# EAGLE design upper_meter (EAGLE 6.5.0)
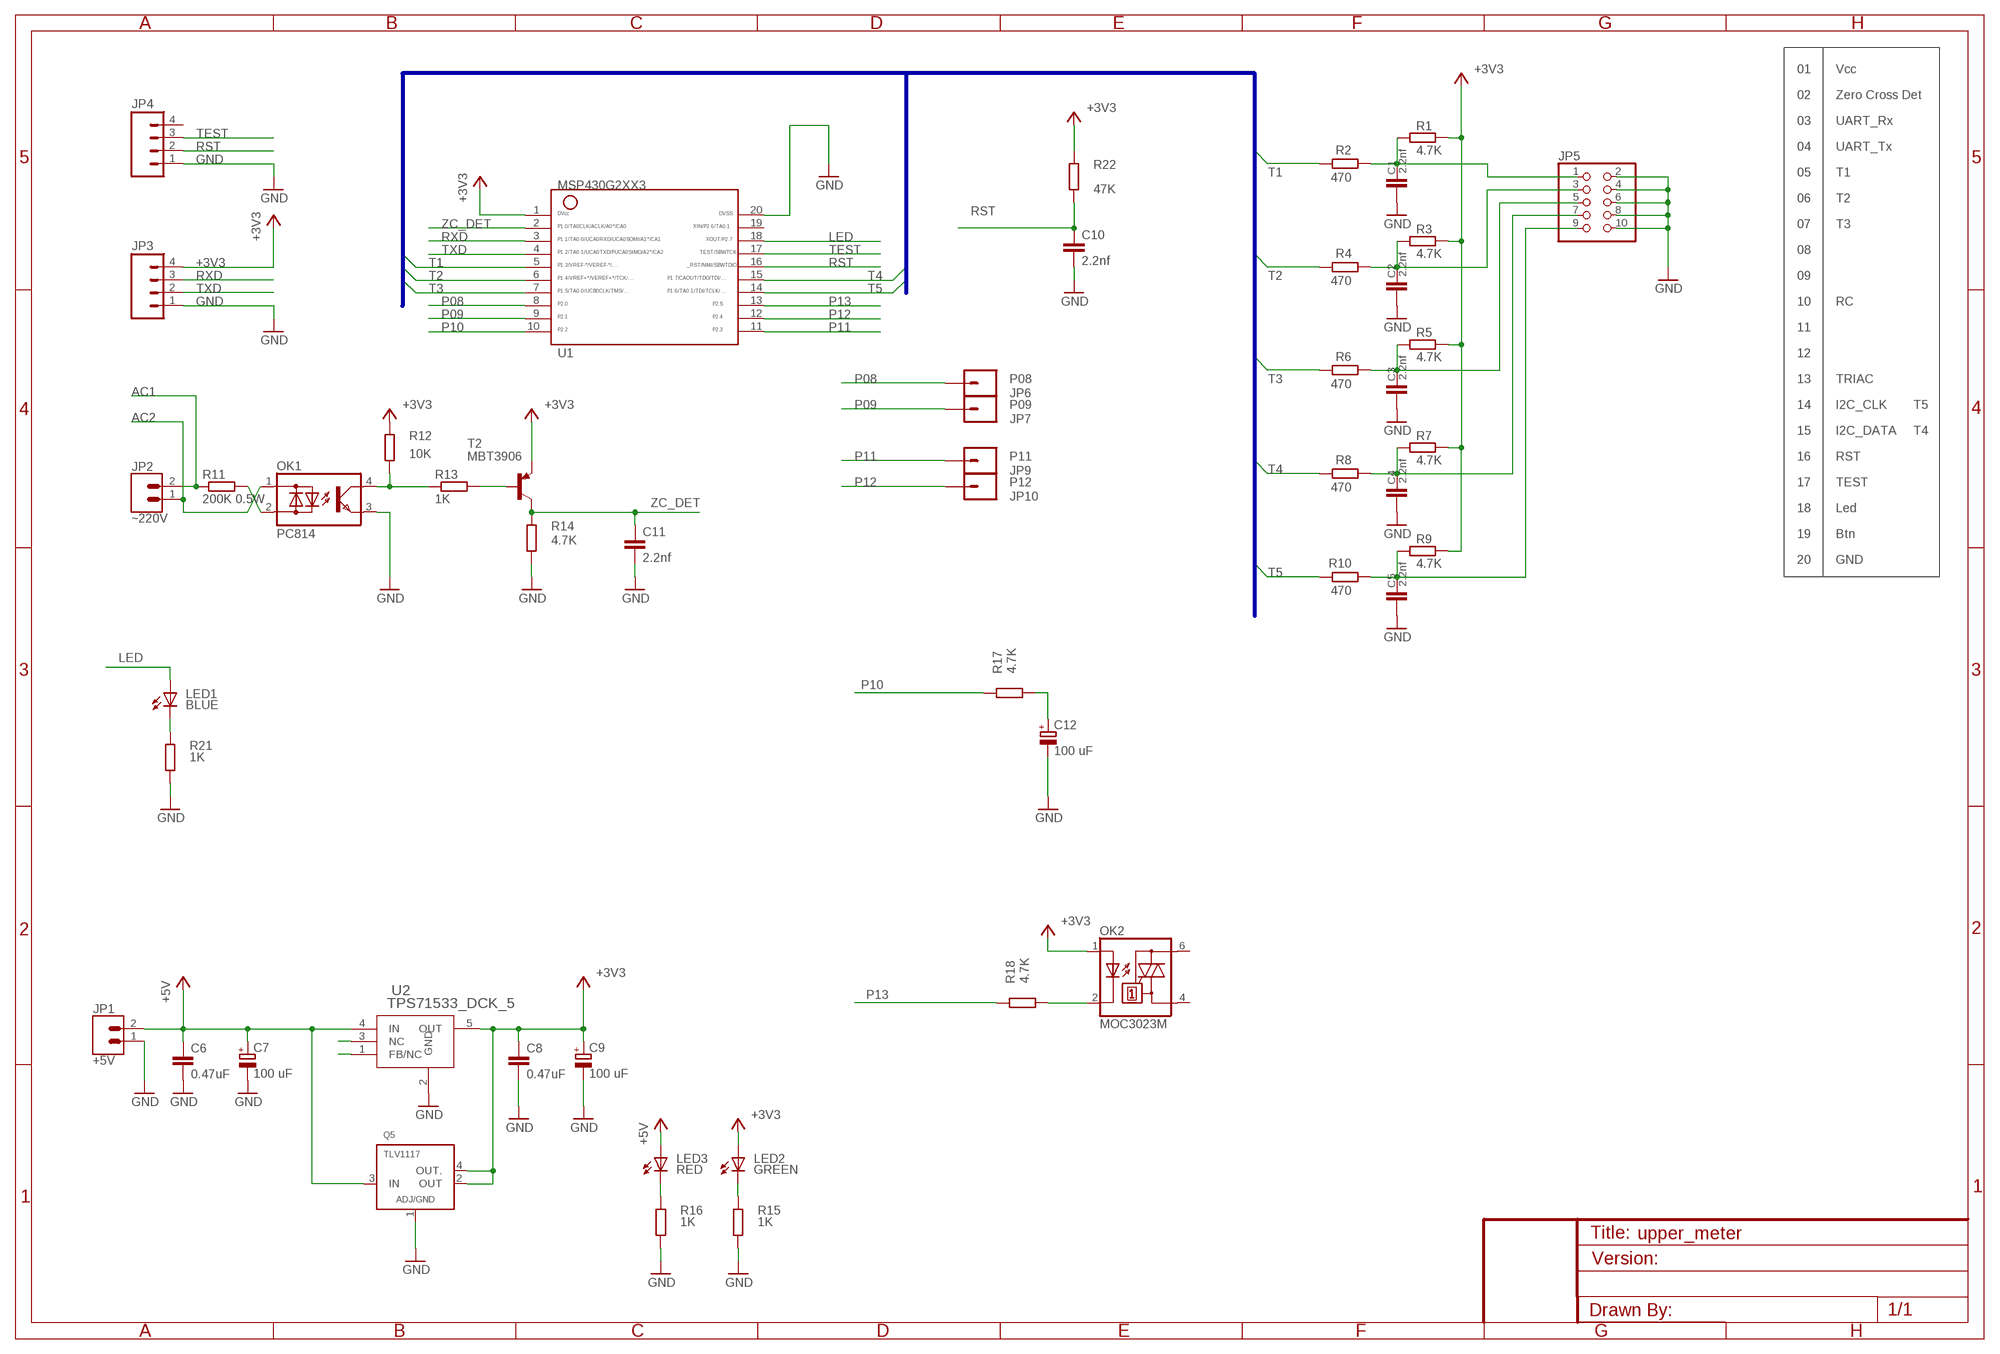
[diagram p0: schematic, sheet 1]

## Parts
C1  2.2nf  C-EUC0805  [C0805]
C2  2.2nf  C-EUC0805  [C0805]
C3  2.2nf  C-EUC0805  [C0805]
C4  2.2nf  C-EUC0805  [C0805]
C5  2.2nf  C-EUC0805  [C0805]
C6  0.47uF  C-EUC0805  [C0805]
C7  100 uF  CPOL-EUE2.5-7  [E2,5-7]
C8  0.47uF  C-EUC0805  [C0805]
C9  100 uF  CPOL-EUE2.5-7  [E2,5-7]
C10  2.2nf  C-EUC0805  [C0805]
C11  2.2nf  C-EUC0805  [C0805]
C12  100 uF  CPOL-EUE2.5-7  [E2,5-7]
JP1  +5V  BLUE_TERM  [BLUE_TERM]
JP2  ~220V  BLUE_TERM  [BLUE_TERM]
JP3  M04PTH  [1X04]
JP4  M04PTH  [1X04]
JP5  PINHD-2X5  [2X05]
JP6  P08  M01PTH  [1X01]
JP7  P09  M01PTH  [1X01]
JP9  P11  M01PTH  [1X01]
JP10  P12  M01PTH  [1X01]
LED1  BLUE  LEDCHIP-LED0805  [CHIP-LED0805]
LED2  GREEN  LEDCHIP-LED0805  [CHIP-LED0805]
LED3  RED  LEDCHIP-LED0805  [CHIP-LED0805]
OK1  PC814  [DIL04]
OK2  MOC3023M  [DIL06]
Q5  TLV1117  [SOT223-4]
R1  4.7K  R-EU_R0805  [R0805]
R2  470  R-EU_R0805  [R0805]
R3  4.7K  R-EU_R0805  [R0805]
R4  470  R-EU_R0805  [R0805]
R5  4.7K  R-EU_R0805  [R0805]
R6  470  R-EU_R0805  [R0805]
R7  4.7K  R-EU_R0805  [R0805]
R8  470  R-EU_R0805  [R0805]
R9  4.7K  R-EU_R0805  [R0805]
R10  470  R-EU_R0805  [R0805]
R11  200K 0.5W  R-EU_0309/12  [0309/12]
R12  10K  R-EU_R0805  [R0805]
R13  1K  R-EU_R0805  [R0805]
R14  4.7K  R-EU_R0805  [R0805]
R15  1K  R-EU_R0805  [R0805]
R16  1K  R-EU_R0805  [R0805]
R17  4.7K  R-EU_R0805  [R0805]
R18  4.7K  R-EU_R0805  [R0805]
R21  1K  R-EU_R0805  [R0805]
R22  47K  R-EU_R0805  [R0805]
T2  MBT3906  MMBT3906LT1-PNP-SOT23-BEC  [SOT23-BEC]
U1  G2XX3---PW20  [PW20]
U2  TPS71533_DCK_5  [DCK5]

## Nets
+3V3 [3V]: C8.1 C9.+ JP3.4 LED2.A OK2.1(A) Q5.2(OUT) Q5.4(OUT.) R1.1 R3.1 R5.1 R7.1 R9.1 R12.2 R22.2 T2.E U1.1 U2.5(OUT)
+5V [5V]: C6.1 C7.+ JP1.2 LED3.A Q5.3(IN) U2.4(IN)
AC1: JP2.2 R11.1
AC2: JP2.1 OK1.1(AC1)
GND [GND]: C1.1 C2.1 C3.1 C4.1 C5.1 C6.2 C7.- C8.2 C9.- C10.2 C11.2 C12.- JP1.1 JP3.1 JP4.1 JP5.2 JP5.4 JP5.6 JP5.8 JP5.10 OK1.3(E) Q5.1(ADJ/GND) R14.1 R15.1 R16.1 R21.1 U1.20 U2.2(GND)
LED: LED1.A U1.18
N$1: C2.2 JP5.3 R3.2 R4.2
N$2: C1.2 JP5.1 R1.2 R2.2
N$3: C3.2 JP5.5 R5.2 R6.2
N$4: C4.2 JP5.7 R7.2 R8.2
N$5: C5.2 JP5.9 R9.2 R10.2
N$6: R13.2 T2.B
N$7: LED2.C R15.2
N$8: LED3.C R16.2
N$9: OK1.4(C) R12.1 R13.1
N$10: C12.+ R17.1
N$11: OK2.2(C) R18.1
N$15: OK1.2(AC2) R11.2
N$23: LED1.C R21.2
N$32: U2.3(NC)
N$33: U2.1(FB/NC)
P08: JP6.1 U1.8
P09: JP7.1 U1.9
P10: R17.2 U1.10
P11: JP9.1 U1.11
P12: JP10.1 U1.12
P13: R18.2 U1.13
RST: C10.1 JP4.2 R22.1 U1.16
RXD: JP3.3 U1.3
T1: R2.1 U1.5
T2: R4.1 U1.6
T3: R6.1 U1.7
T4: R8.1 U1.15
T5: R10.1 U1.14
TEST: JP4.3 U1.17
TXD: JP3.2 U1.4
ZC_DET: C11.1 R14.2 T2.C U1.2
Unconnected: JP4.4 OK2.4(A1) OK2.6(A2) U1.19

## Buses
T[1..5]

## Notes on the sheet
- 01 | Vcc
- 02 | Zero Cross Det
- 03 | UART_Rx
- 04 | UART_Tx
- 05 | T1
- 06 | T2
- 07 | T3
- 08
- 09
- 10 | RC
- 11
- 12
- 13 | TRIAC
- 14 | I2C_CLK | T5
- 15 | I2C_DATA | T4
- 16 | RST
- 17 | TEST
- 18 | Led
- 19 | Btn
- 20 | GND

## Library data of the parts
C1-C4 C6 C8 C10 C11 = rcl:C-EU: CAPACITOR, European symbol
C5 = resistor:C-EU: CAPACITOR, European symbol
C7 C9 C12 = rcl:CPOL-EU: POLARIZED CAPACITOR, European symbol
JP1 JP2 = jlab:BLUE_TERM
JP3 JP4 = SparkFun:M04: Header 4 Standard 4-pin 0.1" header. Use with straight break away headers (SKU : PRT-00116), right angle break away headers (PRT-00553), swiss pins (PRT-00743), machine pins (PRT-00117), and female headers (PRT-00115). Molex polarized connector foot print use with SKU : PRT-08231 with associated crimp pins and housings. 1MM SMD Version SKU: PRT-10208
JP5 = pinhead:PINHD-2X5: PIN HEADER
JP6 JP7 JP9 JP10 = SparkFun:M01: Header 1 Standard 1-pin 0.1" header. Use with straight break away headers (SKU : PRT-00116), right angle break away headers (PRT-00553), swiss pins (PRT-00743), machine pins (PRT-00117), and female headers (PRT-00115).
LED1-LED3 = jlab:LED: LED OSRAM: - CHIPLED LG R971, LG N971, LY N971, LG Q971, LY Q971, LO R971, LY R971 LH N974, LH R974 LS Q976, LO Q976, LY Q976 LO Q996 - Hyper CHIPLED LW Q18S LB Q993, LB Q99A, LB R99A - SideLED LS A670, LO A670, LY A670, LG A670, LP A670 LB A673, LV A673, LT A673, LW A673 LH A674 LY A675 LS A676, LA A676, LO A676, LY A676, LW A676 LS A679, LY A679, LG A679 - Hyper Micro SIDELED® LS Y876, LA Y876, LO Y876, LY Y876 LT Y87S - SmartLED LW L88C, LW L88S LB L89C, LB L89S, LG L890 LS L89K, LO L89K, LY L89K LS L896, LA L896, LO L896, LY L896 - TOPLED LS T670, LO T670, LY T670, LG T670, LP T670 LSG T670, LSP T670, LSY T670, LOP T670, LYG T670 LG T671, LOG T671, LSG T671 LB T673, LV T673, LT T673, LW T673 LH T674 LS T676, LA T676, LO T676, LY T676, LB T676, LH T676, LSB T676, LW T676 LB T67C, LV T67C, LT T67C, LS T67K, LO T67K, LY T67K, LW E67C LS E67B, LA E67B, LO E67B, LY E67B, LB E67C, LV E67C, LT E67C LW T67C LS T679, LY T679, LG T679 LS T770, LO T770, LY T770, LG T770, LP T770 LB T773, LV T773, LT T773, LW T773 LH T774 LS E675, LA E675, LY E675, LS T675 LS T776, LA T776, LO T776, LY T776, LB T776 LHGB T686 LT T68C, LB T68C - Hyper Mini TOPLED® LB M676 - Mini TOPLED Santana® LG M470 LS M47K, LO M47K, LY M47K Source: http://www.osram.convergy.de LUXEON: - LUMILED® LXK2-PW12-R00, LXK2-PW12-S00, LXK2-PW14-U00, LXK2-PW14-V00 LXK2-PM12-R00, LXK2-PM12-S00, LXK2-PM14-U00 LXK2-PE12-Q00, LXK2-PE12-R00, LXK2-PE12-S00, LXK2-PE14-T00, LXK2-PE14-U00 LXK2-PB12-K00, LXK2-PB12-L00, LXK2-PB12-M00, LXK2-PB14-N00, LXK2-PB14-P00, LXK2-PB14-Q00 LXK2-PR12-L00, LXK2-PR12-M00, LXK2-PR14-Q00, LXK2-PR14-R00 LXK2-PD12-Q00, LXK2-PD12-R00, LXK2-PD12-S00 LXK2-PH12-R00, LXK2-PH12-S00 LXK2-PL12-P00, LXK2-PL12-Q00, LXK2-PL12-R00 Source: www.luxeon.com KINGBRIGHT: KA-3528ASYC Source: www.kingbright.com
OK1 = optocoupler:PC814: SHARP OPTO COUPLER; OC_FARNELL: 9707662; OC_NEWARK: unknown
OK2 = optocoupler:MOC30*M: RANDOM-PHASE OPTOISOLATORS TRIAC DRIVER OUTPUT Source: http://www.fairchildsemi.com MOC3020-M.pdf; MF: FAIRCHILD SEMICONDUCTOR; MPN: MOC3023-M; OC_FARNELL: 1021367; OC_NEWARK: 72K8896
Q5 = ti-parts:TLV1117: LDO VOLTAGE REGULATOR
R1-R18 R21 R22 = rcl:R-EU_: RESISTOR, European symbol
T2 = transistor-neu-to92:*-PNP-: PNP Transistror
U1 = TI_MSP430_v16:G2XX3---PW20: MSP430G2XX1 TSSOP (PW) 20 Pin Package
U2 = ti_exports:TPS71533_DCK_5; DATASHEETURL: http://www.ti.com/lit/gpn/TPS71533; DESCRIPTION: Single Output LDO, 50mA, Fixed(3.3V), High Input Voltage, Low Quiescent Current; FAMILY_NAME: SINGLE CHANNEL LDO; GENERIC_PART_NUMBER: TPS71533; INDUSTRY_STD_PKG_TYPE: SC70; MANUFACTURER: Texas Instruments; MANUFACTURER_PART_NUMBER: tps71533_dck_5; PACKAGE_DESIGNATOR: DCK; PIN_COUNT: 5; VENDOR: Texas Instruments

## Net classes
1 5V: width 0.305 mm, drill 0.305 mm, clearance 0.305 mm
2 3V: width 0.305 mm, drill 0.305 mm, clearance 0.305 mm
3 GND: width 0.305 mm, clearance 0.305 mm

## Board
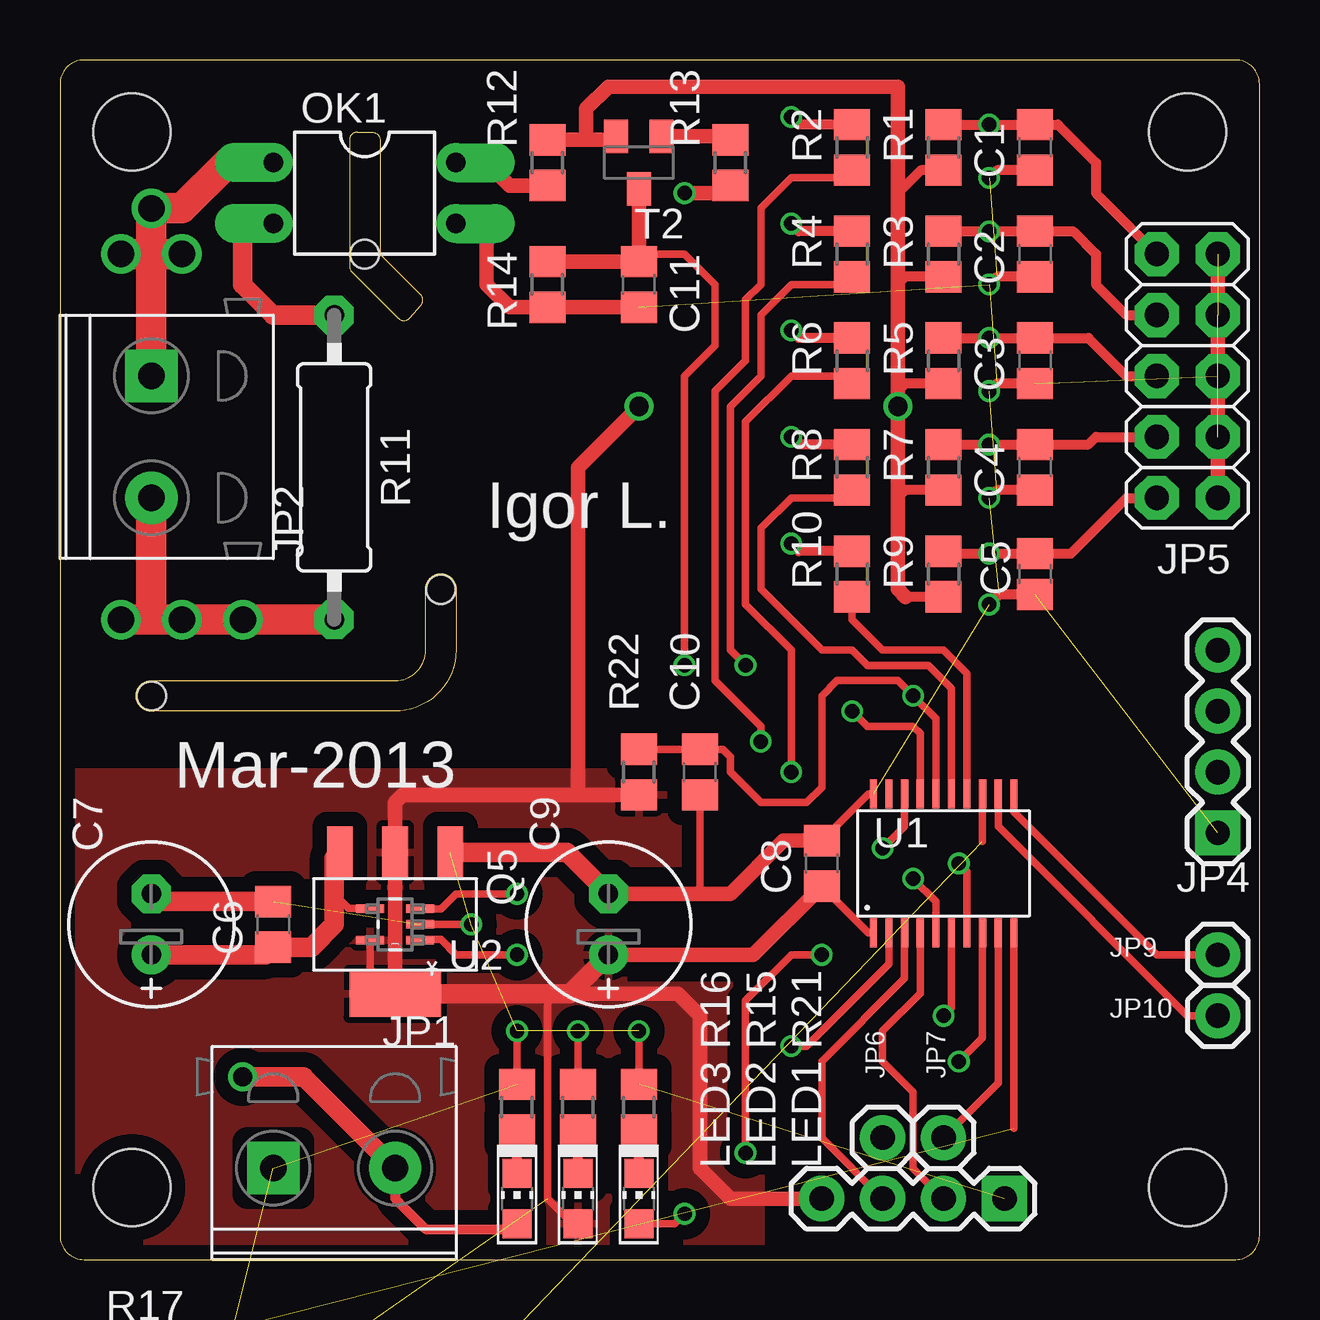
[diagram p1: board, top side]
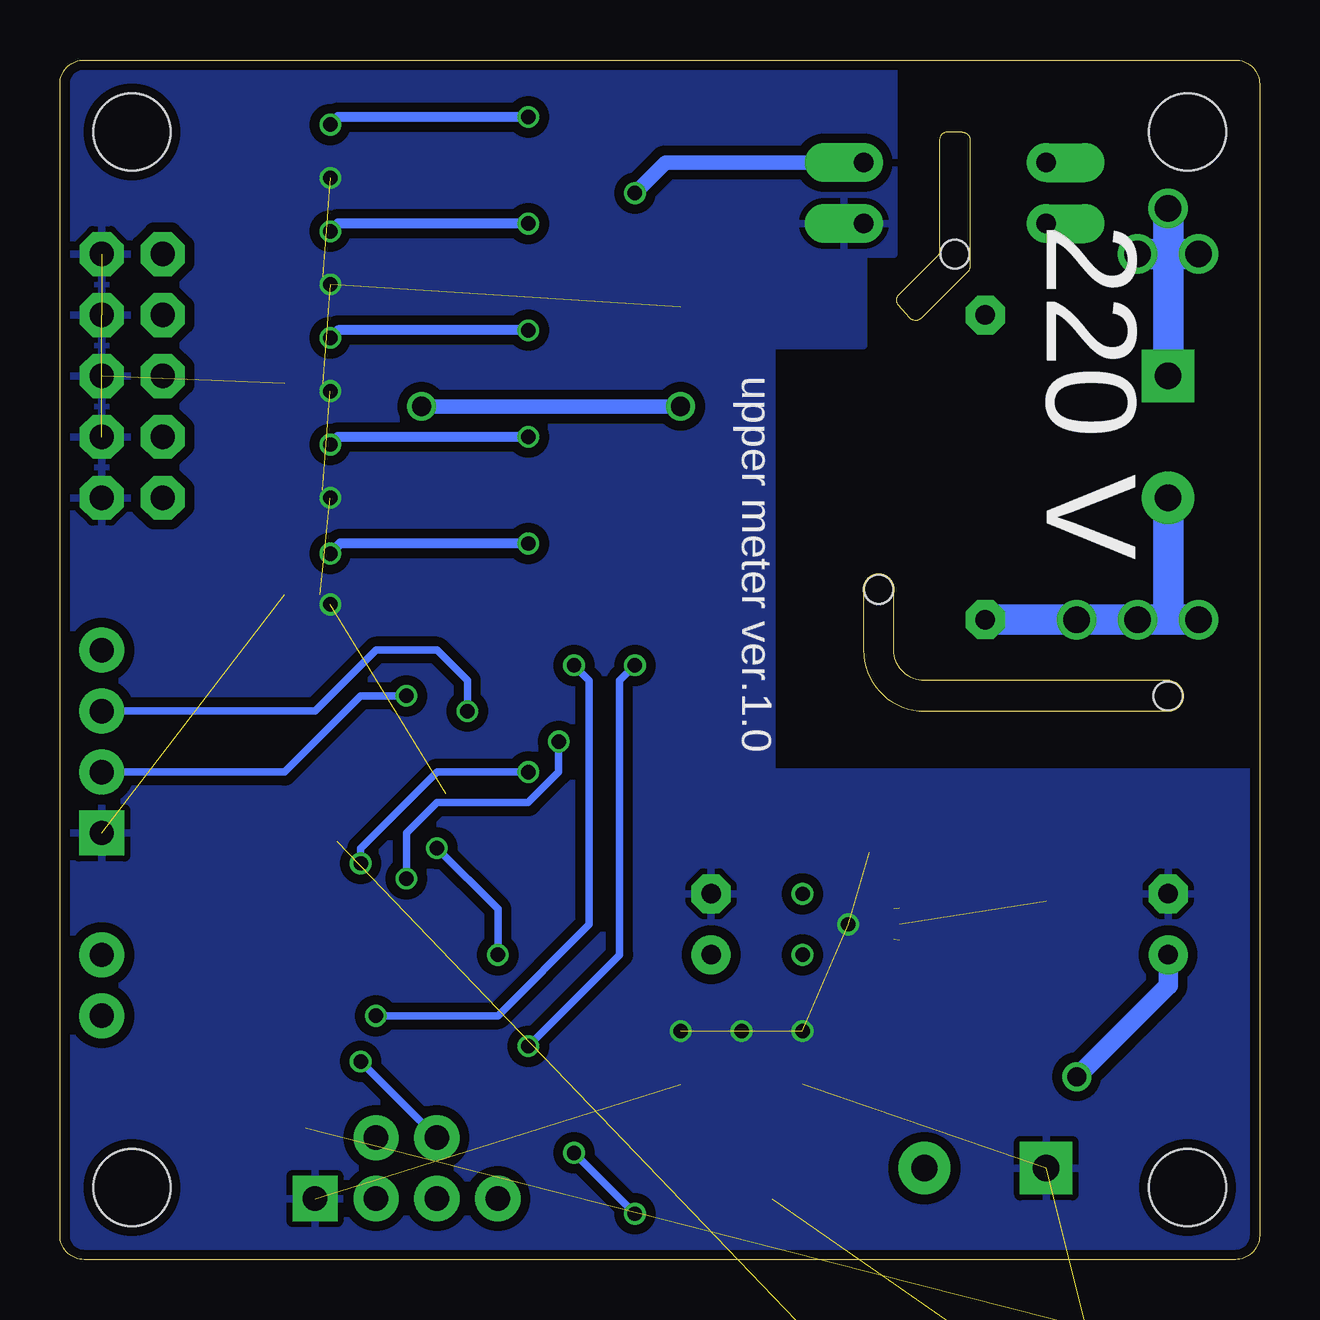
[diagram p2: board, bottom side, seen from below]

Size 50 x 50 mm. Coordinates in mm from the lower left corner, seen from the top.
Outline: 0,49 0,1 arc90 1,0 49,0 arc90 50,1 50,49 arc90 49,50 1,50 arc90 0,49
Copper layers (1*16): Top 0.035mm / dielectric 1.5mm / Bottom 0.035mm
Design rules "msp430": minimum track width 11mil, minimum drill 0.6mm, track to track 6mil, track to pad 6mil, pad to pad 6mil, via to via 6mil, smd to smd 0mil, copper to edge 10mil, drill to drill 10mil, minimum pad ring 16mil, minimum via ring 6mil, stop-mask expansion 2mil, vias tented up to drill 40mil, thermal gap 10mil
Holes 3.2 mm at 3,3 47,3 47,47 3,47
Holes 1.2 mm at 12.7,41.91 15.88,27.94 3.81,23.5
Milling: 20 lines

### Footprints (pad centres in the part's own frame; a part is rotated, then mirrored left to right if it is on the bottom)
C0805 = smd 1.3 x 1.5: 1 -0.95,0; 2 0.95,0
C0805' = smd 1.3 x 1.5: 1 -0.85,0; 2 0.85,0
E2,5-7 = drill 0.813 pad 1.6: + -1.27,0 | drill 0.813 pad 1.6 octagon: - 1.27,0
BLUE_TERM = drill 1.1 pad 2.184 square: 1 0,2.54 | drill 1.1 pad 2.184: 2 0,-2.54
1X04 = drill 1.016 pad 1.88 square: 1 0,0 | drill 1.016 pad 1.88: 2 2.54,0; 3 5.08,0; 4 7.62,0
2X05 = drill 1.016 octagon: 1 -5.08,-1.27; 2 -5.08,1.27; 3 -2.54,-1.27; 4 -2.54,1.27; 5 0,-1.27; 6 0,1.27; 7 2.54,-1.27; 8 2.54,1.27; 9 5.08,-1.27; 10 5.08,1.27
1X01 = drill 1.016 pad 1.88: 1 0,0
CHIP-LED0805 = smd 1.2 x 1.2: A 0,-1.05; C 0,1.05
DIL04 = drill 0.813 offset: 1 -1.27,-3.81; 2 1.27,-3.81; 3 1.27,3.81; 4 -1.27,3.81
DIL06 = drill 0.813 offset: 1 -2.54,-3.81; 2 0,-3.81; 3 2.54,-3.81; 4 2.54,3.81; 5 0,3.81; 6 -2.54,3.81
SOT223-4 = smd 1.067 x 2.184: 1 -2.3,-3; 2 0,-3; 3 2.3,-3 | smd 3.81 x 1.93: 4 0,2.9
R0805 = smd 1.3 x 1.5: 1 -0.95,0; 2 0.95,0
0309/12 = drill 0.813 octagon: 1 -6.35,0; 2 6.35,0
SOT23-BEC = smd 1 x 1.4: B -0.95,-1.1; C 0,1.1; E 0.95,-1.1
PW20 = smd 0.3 x 1.2: 1 -2.925,-2.9; 2 -2.275,-2.9; 3 -1.625,-2.9; 4 -0.975,-2.9; 5 -0.325,-2.9; 6 0.325,-2.9; 7 0.975,-2.9; 8 1.625,-2.9; 9 2.275,-2.9; 10 2.925,-2.9; 11 2.925,2.9; 12 2.275,2.9; 13 1.625,2.9; 14 0.975,2.9; 15 0.325,2.9; 16 -0.325,2.9; 17 -0.975,2.9; 18 -1.625,2.9; 19 -2.275,2.9; 20 -2.925,2.9
DCK5 = smd 1.168 x 0.356: 1 -1.041,0.66; 2 -1.041,0; 3 -1.041,-0.66; 4 1.041,-0.66; 5 1.041,0.66

### Placement (x,y rotation side)
C1  40.64,46.35 90 top
C2  40.64,41.91 90 top
C3  40.64,37.47 90 top
C4  40.64,33.02 90 top
C5  2.2nf  [C0805']  40.64,28.57 90 top
C6  8.89,13.97 90 top
C7  3.81,13.97 90 top
C8  31.75,16.51 90 top
C9  22.86,13.97 90 top
C10  26.67,20.32 270 top
C11  24.13,40.64 270 top
C12  3.81,-11.43 0 top  (outside the outline)
JP1  11.43,3.81 90 top
JP2  3.81,34.29 0 top
JP3  39.37,2.54 180 top
JP4  48.26,17.78 90 top
JP5  46.99,36.83 270 top
JP6  34.29,5.08 0 top
JP7  36.83,5.08 0 top
JP9  48.26,12.7 270 top
JP10  48.26,10.16 270 top
LED1  24.13,2.54 0 top
LED2  21.59,2.54 0 top
LED3  19.05,2.54 0 top
OK1  12.7,44.45 270 top
OK2  -6.35,-13.97 0 top  (outside the outline)
Q5  13.97,13.97 180 top
R1  36.83,46.35 90 top
R2  33.02,46.35 90 top
R3  36.83,41.91 90 top
R4  33.02,41.91 90 top
R5  36.83,37.47 90 top
R6  33.02,37.47 90 top
R7  36.83,33.02 90 top
R8  33.02,33.02 90 top
R9  36.83,28.57 90 top
R10  33.02,28.57 90 top
R11  11.43,33.02 90 top
R12  20.32,45.72 90 top
R13  27.94,45.72 90 top
R14  20.32,40.64 90 top
R15  21.59,6.35 270 top
R16  19.05,6.35 270 top
R17  2.54,-3.81 0 top  (outside the outline)
R18  2.54,-19.05 0 top  (outside the outline)
R21  24.13,6.35 270 top
R22  24.13,20.32 270 top
T2  24.13,45.72 180 top
U1  36.83,16.51 0 top
U2  13.97,13.97 180 top

### Tracks (layer width: path | path; a pad name or v marks a point on that pad's centre or on a via)
+3V3  (via drill 0.8)  (1 unrouted)
  Top 0.305: U2.5 12.93,12.11 Q5.4 | LED2.A 21.37,1.49 20.32,2.54 20.32,11.07 | C8.1 33.7,13.61 U1.1
  Top 0.406: R1.1 35.88,45.41 34.92,44.45 | R3.1 35.24,40.96 34.92,40.64 | R5.1 35.24,36.52 34.92,36.2 | R7.1 35.24,32.07 34.92,31.75 | R9.1 35.24,27.62
  Top 0.61: Q5.4 Q5.2 13.97,19.05 14.29,19.37 21.59,19.37 | R12.2 21.94,46.67 | 21.94,46.67 23.03,46.67 T2.E | 21.94,46.67 21.94,47.97 22.86,48.9 34.92,48.9 34.92,44.45 34.92,40.64 34.92,36.2 v34.92,35.56 34.92,31.75 34.92,27.95 35.24,27.62 | C9.+ 28.89,12.7 C8.1 | R22.2 21.59,19.37 | JP3.4 27.94,2.54 26.67,3.81 26.67,10.16 25.76,11.07 20.32,11.07 | v24.13,35.56 21.59,33.02 21.59,19.37
  Top 0.813: Q5.4 20.32,11.07 21.23,11.07 C9.+
  Bottom 0.61: v34.92,35.56 v24.13,35.56
  pour Top (isolate 0.61): 0,20.32 29.21,20.32 29.21,16.51 23.5,16.51 23.5,11.43 29.21,11.43 29.21,0 1,0 arc-90 0,1
+5V  (via drill 0.8)
  Top 0.305: U2.4 12.04,14.63 11.43,15.24
  Top 0.406: JP1.2 13.97,2.54 15.24,1.27 18.83,1.27 LED3.A
  Top 0.813: C7.+ 8.57,12.7 C6.1 10.48,13.02 11.43,13.97 11.43,15.24 11.43,16.73 Q5.3 | JP1.2 10.16,7.62 v7.62,7.62
  Bottom 0.813: v7.62,7.62 3.81,11.43 C7.+
AC1  (via drill 1.1)
  Top 1.27: v2.54,26.67 3.81,26.67 | R11.1 v7.62,26.67 v5.08,26.67 3.81,26.67 | JP2.2 3.81,26.67
  Bottom 1.27: JP2.2 3.81,26.67 v2.54,26.67 v5.08,26.67 v7.62,26.67 R11.1
AC2  (via drill 1.1)
  Top 1.27: v2.54,41.91 3.81,41.91 | 3.81,41.91 v5.08,41.91 | JP2.1 3.81,41.91 | 3.81,41.91 v3.81,43.81 5.08,43.81 6.99,45.72 OK1.1
  Bottom 1.27: JP2.1 v3.81,43.81 | v2.54,41.91 v5.08,41.91
GND  (via drill 0.6)  (19 unrouted)
  Top 0.305: U2.2 v17.14,13.97 | R16.1 v19.05,9.53 | R15.1 v21.59,9.53 | R21.1 v24.13,9.53 | C8.2 33.7,19.41 U1.20 | C10.2 26.67,15.24
  Top 0.406: C1.1 39.05,45.41 v38.73,45.09 | C2.1 39.05,40.96 v38.73,40.64 | C3.1 39.05,36.52 v38.73,36.2 | C4.1 39.05,32.07 v38.73,31.75 | C5.1 39.16,27.73 v38.73,27.3
  Top 0.61: C11.2 R14.1 18.73,39.69 17.78,40.64 17.78,43.18 OK1.3 | C9.- 26.67,15.24 27.94,15.24 30.16,17.46 C8.2 | JP5.2 JP5.10
  Top 0.813: C6.2 4.13,14.92 C7.- | Q5.1 21.13,16.97 C9.-
  pour Bottom (isolate 0.406, rank 6): 0,20.32 0,1 arc90 1,0 49,0 arc90 50,1 50,49 arc90 49,50 15.24,50 15.24,41.91 16.51,41.91 16.51,38.1 20.32,38.1 20.32,20.32
LED  (via drill 0.6)
  Top 0.305: U1.18 35.2,18.06 v34.29,17.14 | LED1.A 25.62,1.49 v26.04,1.91 | v31.75,12.7 30.48,12.7 28.57,10.79 v28.57,4.45
  Bottom 0.305: v34.29,17.14 31.75,14.61 v31.75,12.7 | v26.04,1.91 v28.57,4.45
N$1  (via drill 0.6)
  Top 0.406: JP5.3 44.45,39.37 43.18,40.64 43.18,41.91 42.23,42.86 C2.2 v38.73,42.86 R3.2 | R4.2 30.8,42.86 v30.48,43.18
  Bottom 0.406: v30.48,43.18 38.41,43.18 v38.73,42.86
N$2  (via drill 0.6)
  Top 0.406: R1.2 v38.73,47.3 C1.2 41.59,47.3 43.18,45.72 43.18,44.45 JP5.1 | R2.2 30.8,47.3 v30.48,47.62
  Bottom 0.406: v30.48,47.62 38.41,47.62 v38.73,47.3
N$3  (via drill 0.6)
  Top 0.406: JP5.5 44.45,36.83 42.87,38.41 C3.2 v38.73,38.41 R5.2 | R6.2 30.8,38.41 v30.48,38.73
  Bottom 0.406: v30.48,38.73 38.41,38.73 v38.73,38.41
N$4  (via drill 0.6)
  Top 0.406: JP5.7 43.18,34.29 42.86,33.97 C4.2 v38.73,33.97 R7.2 | R8.2 30.8,33.97 v30.48,34.29
  Bottom 0.406: v30.48,34.29 38.41,34.29 v38.73,33.97
N$5  (via drill 0.6)
  Top 0.406: JP5.9 44.45,31.75 42.12,29.43 C5.2 v38.73,29.43 36.93,29.43 R9.2 | R10.2 30.8,29.52 v30.48,29.84
  Bottom 0.406: v30.48,29.84 38.31,29.84 v38.73,29.43
N$6
  Top 0.61: T2.B 27.79,46.82 R13.2
N$7
  Top 0.406: LED2.C R15.2
N$8
  Top 0.406: LED3.C R16.2
N$9  (via drill 0.6)
  Top 0.61: R12.1 18.73,44.77 17.78,45.72 OK1.4 | v26.04,44.45 27.62,44.45 R13.1
  Bottom 0.61: OK1.4 24.77,45.72 v26.04,44.45
N$10  (1 unrouted)
N$11  (1 unrouted)
N$15
  Top 0.813: R11.2 8.89,39.37 7.62,40.64 7.62,43.18 OK1.2
N$23
  Top 0.406: LED1.C R21.2
N$32  (via drill 0.6)  (1 unrouted)
  Top 0.305: 15.24,14.61 15.88,14.61 16.51,15.24 v19.05,15.24
N$33  (via drill 0.6)  (1 unrouted)
  Top 0.305: 15.24,13.34 15.88,13.34 16.51,12.7 v19.05,12.7
P08  (via drill 0.6)
  Top 0.305: U1.8 38.45,9.24 v37.47,8.26
  Bottom 0.305: JP6.1 v37.47,8.26
P09
  Top 0.305: JP7.1 39.1,7.36 U1.9
P10  (1 unrouted)
  Top 0.305: 39.76,5.46 U1.10
P11
  Top 0.305: U1.11 39.76,18.66 45.72,12.7 JP9.1
P12
  Top 0.305: U1.12 39.1,18.05 46.99,10.16 JP10.1
P13  (1 unrouted)
  Top 0.305: U1.13 38.45,17.43
RST  (via drill 0.6)
  Top 0.305: R22.1 C10.1 27.62,21.27 27.94,20.95 27.94,20.32 29.21,19.05 31.11,19.05 31.75,19.68 31.75,23.5 32.38,24.13 34.92,24.13 v35.56,23.5 36.51,22.55 U1.16
  Bottom 0.305: v35.56,23.5 37.47,23.5 40.64,20.32 JP4.2
RXD
  Top 0.305: JP3.3 31.75,5.08 31.75,8.26 35.2,11.71 U1.3
T1  (via drill 0.6)
  Top 0.305: R2.1 32.7,45.09 30.48,45.09 29.21,43.81 29.21,40.64 28.57,40.01 28.57,37.47 27.3,36.2 27.3,24.13 29.21,22.23 v29.21,21.59 | U1.5 36.51,14.93 v35.56,15.88
  Bottom 0.305: v35.56,15.88 35.56,17.78 34.29,19.05 30.48,19.05 29.21,20.32 v29.21,21.59
T2  (via drill 0.6)
  Top 0.305: R4.1 32.7,40.64 30.48,40.64 29.21,39.37 29.21,36.83 27.94,35.56 27.94,25.4 v28.57,24.77 | U1.6 37.16,10.48 v36.83,10.16
  Bottom 0.305: v36.83,10.16 31.75,10.16 27.94,13.97 27.94,24.13 v28.57,24.77
T3  (via drill 0.6)
  Top 0.305: R6.1 32.7,36.83 30.48,36.83 28.57,34.92 28.57,27.3 30.48,25.4 v30.48,20.32 | U1.7 37.8,16.17 v37.47,16.51
  Bottom 0.305: v37.47,16.51 37.47,17.14 34.29,20.32 v30.48,20.32
T4
  Top 0.305: R8.1 32.7,31.75 30.48,31.75 29.21,30.48 29.21,27.94 31.75,25.4 33.02,25.4 33.66,24.77 36.2,24.77 37.16,23.8 U1.15
T5
  Top 0.305: R10.1 33.02,26.67 34.29,25.4 36.83,25.4 37.8,24.43 U1.14
TEST  (via drill 0.6)
  Top 0.305: U1.17 35.85,21.93 35.56,22.23 33.66,22.23 v33.02,22.86
  Bottom 0.305: v33.02,22.86 33.02,24.13 34.29,25.4 36.83,25.4 39.37,22.86 JP4.3
TXD
  Top 0.305: JP3.2 35.56,3.81 35.56,6.99 34.29,8.26 34.29,9.53 35.85,11.09 U1.4
ZC_DET  (via drill 0.6)
  Top 0.305: C11.1 24.45,41.91 26.04,41.91 27.3,40.64 27.3,38.1 26.04,36.83 v26.04,24.77 | U1.2 34.55,12.33 31.11,8.89 v30.48,8.89
  Top 0.61: R14.2 C11.1 T2.C
  Bottom 0.305: v30.48,8.89 26.67,12.7 26.67,24.13 v26.04,24.77

### Text on the board
tNames: Igor L. | Mar-2013
bNames: 220 V | upper meter ver.1.0
tDocu: T1 | AC2 | T2 | T3 | T4 | T5 | AC1 | Test / / Rst / / GND | +5V | Vcc / Rx / Tx / GND